# Altium schematic sheet sensors.SchDoc
size A4
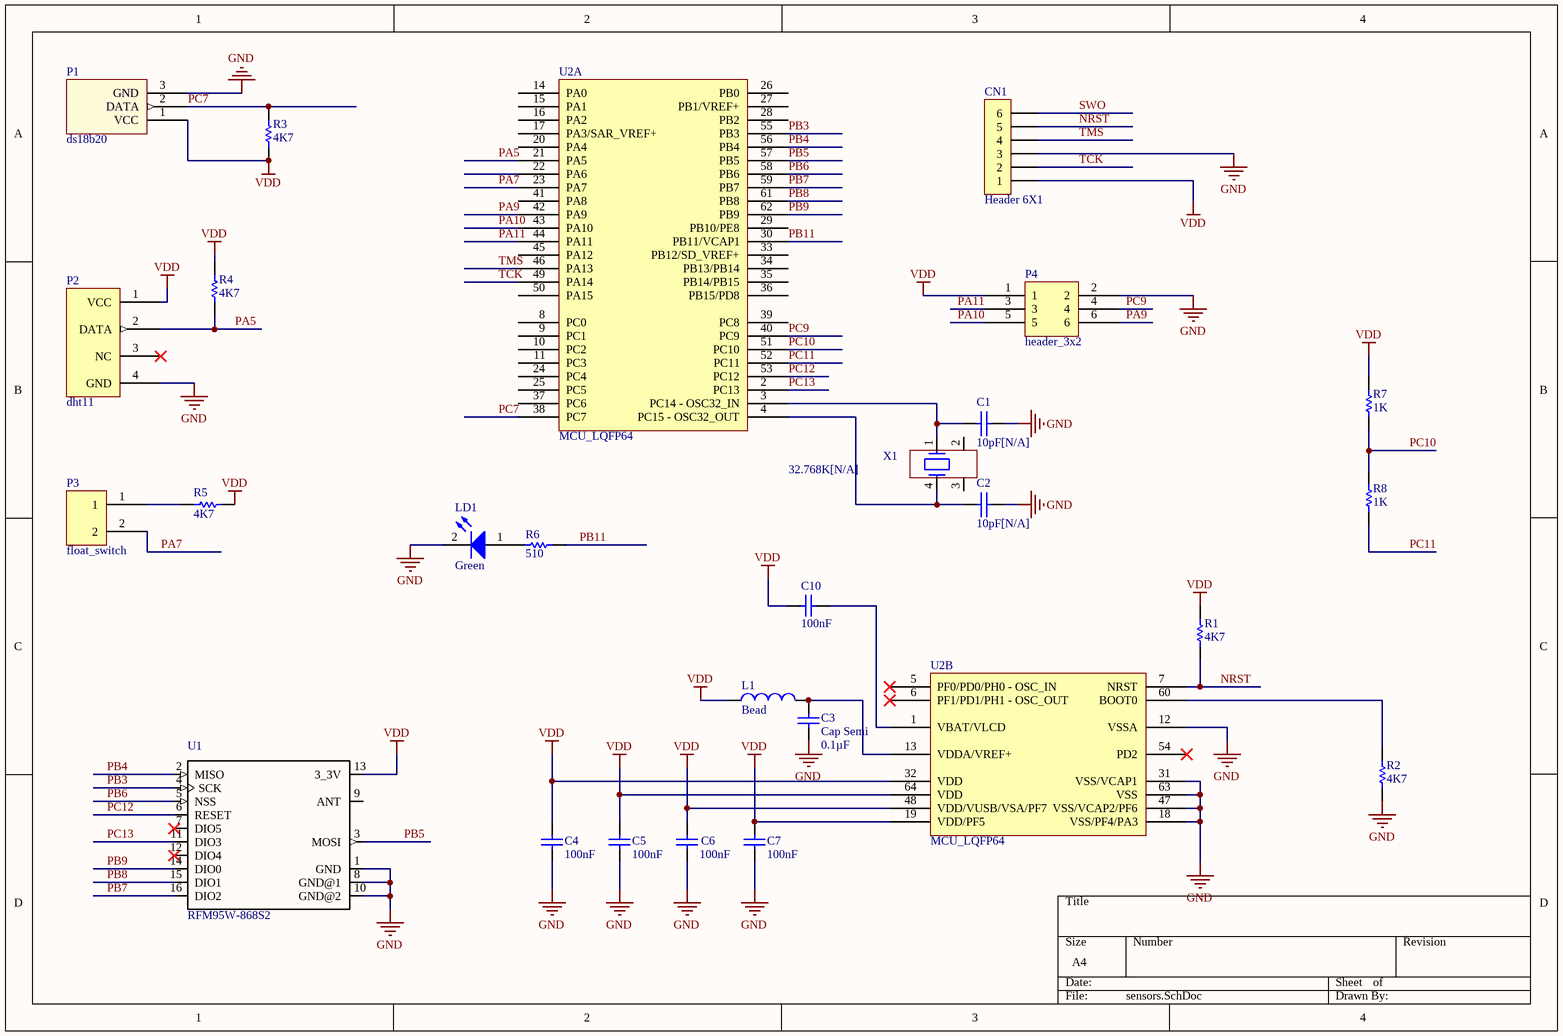
[diagram p0: sensors.SchDoc]

## Parts
C1  10pF[N/A]  [0603C]
C2  10pF[N/A]  [0603C]
C3  Cap Semi  value 0.1µF  [1608[0603]]
C4  100nF  [0603C]
C5  100nF  [0603C]
C6  100nF  [0603C]
C7  100nF  [0603C]
C10  100nF  [0603C]
CN1  Header 6X1  [1*6P]
L1  Bead  [INDC1608L]
LD1  Green  [0603D]
P1  ds18b20  [ds18b20]
P2  dht11  [dht11]
P3  float_switch  [float_switch]
P4  header_3x2  [header_3x2]
R1  4K7  [0603R]
R2  4K7  [0603R]
R3  4K7  [0603R]
R4  4K7  [0603R]
R5  4K7  [0603R]
R6  510  [0603R]
R7  1K  [0603R]
R8  1K  [0603R]
U1  RFM95W-868S2  [XCVR_RFM95W-868S2]
U2  MCU_LQFP64  [LQFP64]  (parts A,B of 2)
X1  32.768K[N/A]  [XTAL_4SM_8X3R8]

## Nets
GND: C1.2 C2.2 C3.2 C4.2 C5.2 C6.2 C7.2 CN1.3 LD1.2(K) P1.3(GND) P2.4(GND) P4.2 R2.1 U1.1(GND) U1.8(GND@1) U1.10(GND@2) U2.12(VSSA) U2.18(VSS/PF4/PA3) U2.31(VSS/VCAP1) U2.47(VSS/VCAP2/PF6) U2.63(VSS)
VDD: C4.1 C5.1 C6.1 C7.1 C10.1 CN1.1 L1.1 P1.1(VCC) P2.1(VCC) P4.1 R1.2 R3.2 R4.1 R5.1 R7.1 U1.13(3_3V) U2.19(VDD/PF5) U2.32(VDD) U2.48(VDD/VUSB/VSA/PF7) U2.64(VDD)
NRST: CN1.5 R1.1 U2.7(NRST)
PA5: P2.2(DATA) R4.2 U2.21(PA5)
PA7: P3.2 U2.23(PA7)
PA9: P4.6 U2.42(PA9)
PA10: P4.5 U2.43(PA10)
PA11: P4.3 U2.44(PA11)
PB3: U1.4(SCK) U2.55(PB3)
PB4: U1.2(MISO) U2.56(PB4)
PB5: U1.3(MOSI) U2.57(PB5)
PB6: U1.5(NSS) U2.58(PB6)
PB7: U1.16(DIO2) U2.59(PB7)
PB8: U1.15(DIO1) U2.61(PB8)
PB9: U1.14(DIO0) U2.62(PB9)
PB11: R6.1 U2.30(PB11/VCAP1)
PC7: P1.2(DATA) R3.1 U2.38(PC7)
PC9: P4.4 U2.40(PC9)
PC10: R7.2 R8.1 U2.51(PC10)
PC11: R8.2 U2.52(PC11)
PC12: U1.6(RESET) U2.53(PC12)
PC13: U1.11(DIO3) U2.2(PC13)
SWO: CN1.6
TCK: CN1.2 U2.49(PA14)
TMS: CN1.4 U2.46(PA13)
NetC1_1: C1.1 U2.3(PC14_-_OSC32_IN) X1.1
NetC2_1: C2.1 U2.4(PC15_-_OSC32_OUT) X1.4
NetC3_1: C3.1 L1.2 U2.13(VDDA/VREF+)
NetC10_2: C10.2 U2.1(VBAT/VLCD)
NetLD1_1: LD1.1(A) R6.2
NetP3_1: P3.1 R5.2
NetR2_2: R2.2 U2.60(BOOT0)

Not connected (* = marked no-connect by the designer): P2 3(NC)*; U1 7(DIO5)* 9(ANT) 12(DIO4)*; U2 5(PF0/PD0/PH0_-_OSC_IN)* 6(PF1/PD1/PH1_-_OSC_OUT)* 8(PC0) 9(PC1) 10(PC2) 11(PC3) 14(PA0) 15(PA1) 16(PA2) 17(PA3/SAR_VREF+) 20(PA4) 22(PA6) 24(PC4) 25(PC5) 26(PB0) 27(PB1/VREF+) 28(PB2) 29(PB10/PE8) 33(PB12/SD_VREF+) 34(PB13/PB14) 35(PB14/PB15) 36(PB15/PD8) 37(PC6) 39(PC8) 41(PA8) 45(PA12) 50(PA15) 54(PD2)*; X1 2 3

## Library data of the parts
C1 = Cap: Capacitor; Manufacturer: Murata Electronics North America; ProductNumber: GRM1885C1H100JA01D; Value: 10pF; Vendor name: Digikey; Vendor PN: 490-1403-1-ND; Price: 0,10; Stock: 119.425
C2 = CAP: Capacitor; Manufacturer: Murata Electronics North America; ProductNumber: GRM1885C1H100JA01D; Value: 10pF; Vendor name: Digikey; Vendor PN: 490-1403-1-ND; Price: 0,10; Stock: 119.425
C3 = Cap Semi: Capacitor (Semiconductor SIM Model); Manufacturer: AVX Corporation; ProductNumber: C1608X5R1H104K080AA; Vendor name: Digikey; Vendor PN: 478-6206-1-ND; Published: 8-Jun-2000; LatestRevisionDate: 29-May-2009; LatestRevisionNote: IPC-7351 Footprint Added.; PackageReference: C1206; Publisher: Altium Limited; PackageDescription: Chip Capacitor; Price: 0.29; Stock: 35
C4-C6 C10 = Cap: Capacitor; Manufacturer: AVX Corporation; Value: 0.1µF; ProductNumber: C1608X5R1H104K080AA; Vendor name: Digikey; Vendor PN: 478-6206-1-ND; Published: 8-Jun-2000; Revision: July-2002: Re-released for DXP Platform.; Publisher: Altium Limited; Price: 0.29; Stock: 35
C7 = Cap: Capacitor; Manufacturer: AVX Corporation; Value: 0.1uF; ProductNumber: 06035D104KAT2A; Vendor name: Digikey; Vendor PN: 478-6206-1-ND; Published: 8-Jun-2000; Revision: July-2002: Re-released for DXP Platform.; Publisher: Altium Limited; Price: 0,29; Stock: 35
CN1 = Header 6X1: Header, 6-Pin, Single row; Manufacturer: Molex; ProductNumber: 0022232061; Vendor name: Digikey; Vendor PN: WM4204-ND; LatestRevisionDate: 17-Jul-2002; LatestRevisionNote: Re-released for DXP Platform.; Publisher: Altium Limited; Price: 0,41; Stock: 26.758
L1 = Inductor: Manufacturer: Taiyo Yuden; Code_IEC: 1005; Value: 600 OHM; ProductNumber: BK1608HS601-T; Vendor name: Digikey; Vendor PN: 587-1874-1-ND; Published: 8-Jun-2000; LatestRevisionDate: 29-May-2009; LatestRevisionNote: IPC-7351 Footprint Added.; PackageReference: 0402-A; Publisher: Altium Limited; PackageDescription: Chip Inductor; Code_JEITA: 0402; Price: 0.10; Stock: 40,993
LD1 = LED2: Typical RED, GREEN, YELLOW, AMBER GaAs LED; Manufacturer: Lite-On; ProductNumber: LTST-C190KGKT; Value: 571nm; Vendor name: Digikey; Vendor PN: 160-1435-1-ND; Published: 8-Jun-2000; Revision: July-2002: Re-released for DXP Platform.; Publisher: Altium Limited; Price: 0.27; Stock: 1,780,452
P1 = ds18b20: Manufacturer: Wurth Electronics; ProductNumber: 61300311121; Vendor name: Digikey; Vendor PN: 732-5316-ND; Price: 0,14; Stock: 67.713
P3 = float_switch: Manufacturer: Harwin Inc.; ProductNumber: M20-9990246; Vendor name: Digikey; Vendor PN: 952-2262-ND; Price: 0,11; Stock: 39.078
P4 = header_3x2: Manufacturer: Amphenol FCI; ProductNumber: 20021111-00006T4LF; Vendor name: Digikey; Vendor PN: 609-3710-ND; Price: 0,45; Stock: 4.920
R1-R5 = Res1: Resistor; Manufacturer: Yageo; Value: 4.7 kOhms; ProductNumber: RC0603JR-074K7L; Vendor name: Digikey; Vendor PN: 311-4.7KGRCT-ND; Published: 8-Jun-2000; Publisher: Altium Limited; Revision: July-2002: Re-released for DXP Platform.; Price: 0,10; Stock: 3.704.975
R6 = Res1: Resistor; Manufacturer: Rohm Semiconductor; Value: 510 Ohms; ProductNumber: ESR03EZPJ511; Vendor name: Digikey; Vendor PN: RHM510DCT-ND; Published: 8-Jun-2000; Revision: July-2002: Re-released for DXP Platform.; Publisher: Altium Limited; Price: 0.10; Stock: 24,289
R7 R8 = Res1: Resistor; Manufacturer: Susumu; Value: 1 kOhm; ProductNumber: RR0816P-102-D; Vendor name: Digikey; Vendor PN: RR08P1.0KDCT-ND; Published: 8-Jun-2000; Revision: July-2002: Re-released for DXP Platform.; Publisher: Altium Limited; Price: 0.11; Stock: 492,396
U1 = RFM95W-868S2: Manufacturer: RF Solutions; MF: Hope Microelectronics; Vendor name: Digikey; Vendor PN: RFM95W-868S2-ND; MP: RFM95W-868S2; Availability: Warning; Price: 15,16; Package: SMD-16 Hope Microelectronics; Value: *; ProductNumber: RFM95W-868S2; Stock: 467
U2 = MCU_LQFP64: Manufacturer: STM; ProductNumber: STM32L476RGT6; Vendor name: Mouser; Vendor PN: 511-STM32L476RGT6; Price: 7,76; Stock: 4.505
X1 = MC306